# EAGLE design Relay (EAGLE 6.6.0)
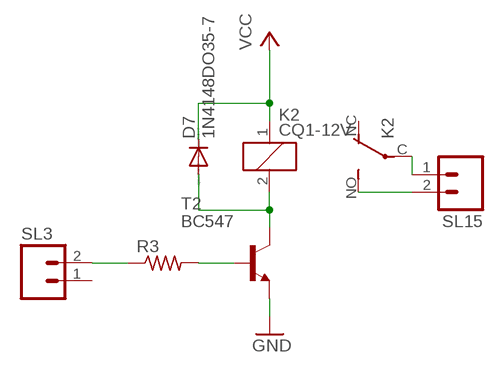
[diagram p0: schematic, sheet 1]

## Parts
D7  1N4148DO35-7  [DO35-7]
K2  CQ1-12V  [CQ1]
R3  R-US_0204/7  [0204/7]
SL3  M02  [02P]
SL15  M02  [02P]
T2  BC547  [TO92]

## Nets
GND: T2.1(E)
N$39: D7.A K2.2 T2.3(C)
N$40: R3.2 T2.2(B)
N$41: K2.NO(2:S) SL15.2
N$42: K2.C(2:P) SL15.1
N$43: R3.1 SL3.2
VCC: D7.C K2.1
Unconnected: K2.NC(2:O) SL3.1

## Library data of the parts
D7 = diode:1N4148: DIODE high speed (Philips)
K2 = relay:CQ1-12V: AUTOMOTIVE QUIET RELAY NAiS Source: http://www.mew-europe.com/.. en_ds_61208_0000.pdf; OC_FARNELL: unknown; OC_NEWARK: unknown
R3 = resistor:R-US_: RESISTOR, American symbol
SL3 SL15 = con-amp-quick:M02: AMP QUICK CONNECTOR; OC_FARNELL: unknown; OC_NEWARK: unknown
T2 = transistor:BC547: NPN TRANSISTOR

## Board
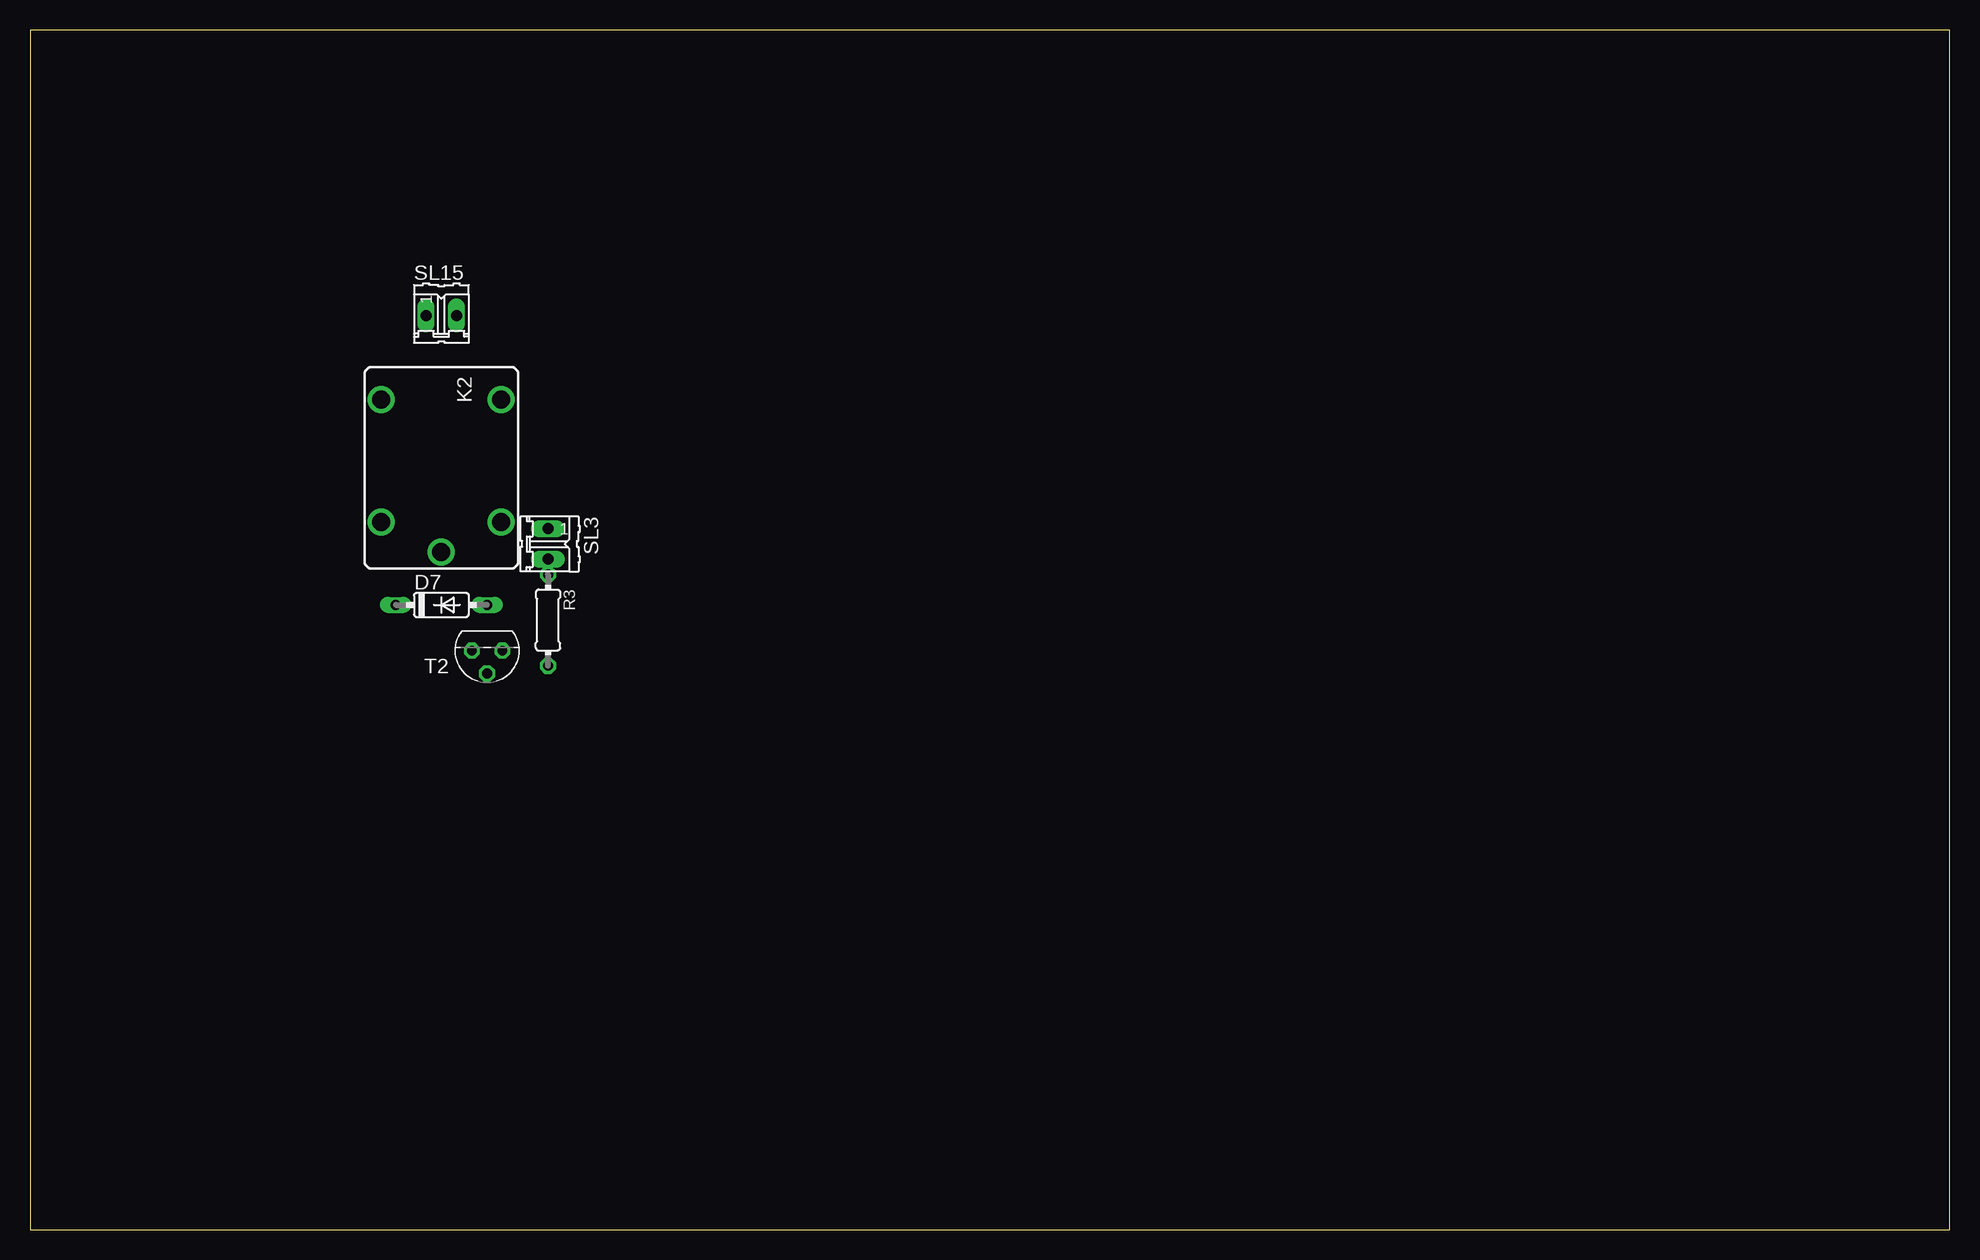
[diagram p1: board, top side]
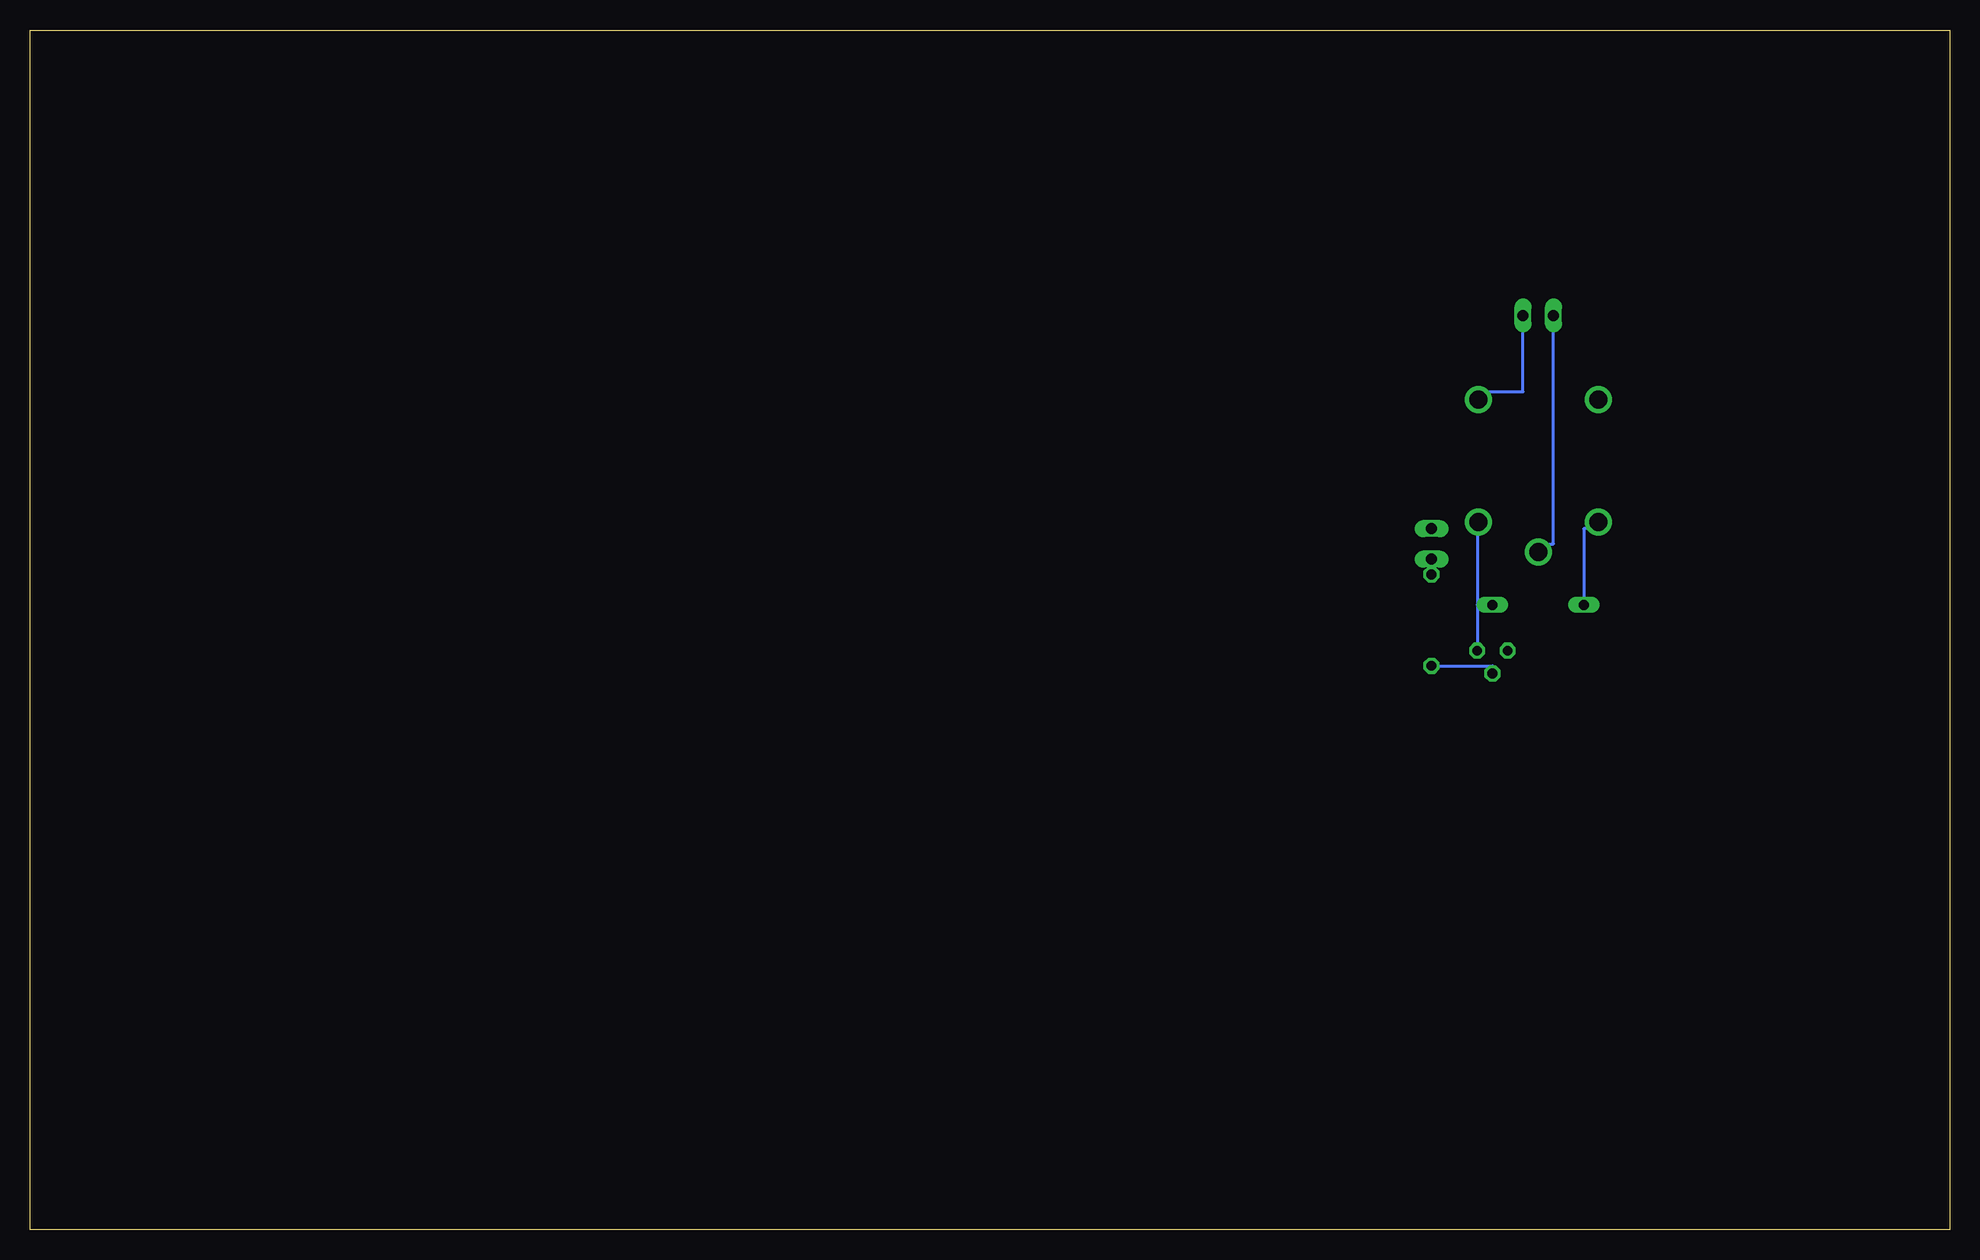
[diagram p2: board, bottom side, seen from below]

Size 160 x 100 mm. Coordinates in mm from the lower left corner, seen from the top.
Outline: 0,0 160,0 160,100 0,100 0,0
Copper layers (1*16): Top 0.035mm / dielectric 1.5mm / Bottom 0.035mm
Design rules "default": minimum track width 10mil, minimum drill 24mil, track to track 8mil, track to pad 8mil, pad to pad 8mil, via to via 8mil, smd to smd 8mil, copper to edge 40mil, drill to drill 8mil, minimum pad ring 10mil, minimum via ring 8mil, stop-mask expansion 4mil, vias tented up to drill 0mil, thermal gap 10mil

### Footprints (pad centres in the part's own frame; a part is rotated, then mirrored left to right if it is on the bottom)
DO35-7 = drill 0.813 long: A 3.81,0; C -3.81,0
CQ1 = drill 1.5: 1 4.5,-5; 2 4.5,5; C 7,0; NC -5.7,-5; NO -5.7,5
0204/7 = drill 0.813 octagon: 1 -3.81,0; 2 3.81,0
02P = drill 0.914 long: 1 -1.27,0; 2 1.27,0
TO92 = drill 0.813 octagon: 1 1.27,0; 2 0,1.905; 3 -1.27,0

### Placement (x,y rotation side)
D7  34.29,52.07 0 top
K2  34.29,63.5 270 top
R3  43.18,50.8 270 top
SL3  43.18,57.15 270 top
SL15  34.29,76.2 0 top
T2  38.1,48.26 180 top

### Tracks (layer width: path | path; a pad name or v marks a point on that pad's centre or on a via)
N$39
  Bottom 0.254: 39.37,52.07 T2.3 | 39.37,52.07 39.37,58.42 K2.2 | 39.37,52.07 D7.A
N$40
  Bottom 0.254: R3.2 38.1,46.99 T2.2
N$41
  Bottom 0.254: SL15.2 35.56,69.85 39.37,69.85 K2.NO
N$42
  Bottom 0.254: SL15.1 33.02,57.15 34.29,57.15 K2.C
N$43
  Bottom 0.254: SL3.2 R3.1
VCC
  Bottom 0.254: D7.C 30.48,58.42 29.21,58.42 K2.1